# EasyEDA schematic EasyEDA SCH_Toasty SMD REFLOW_2022-03-12.json
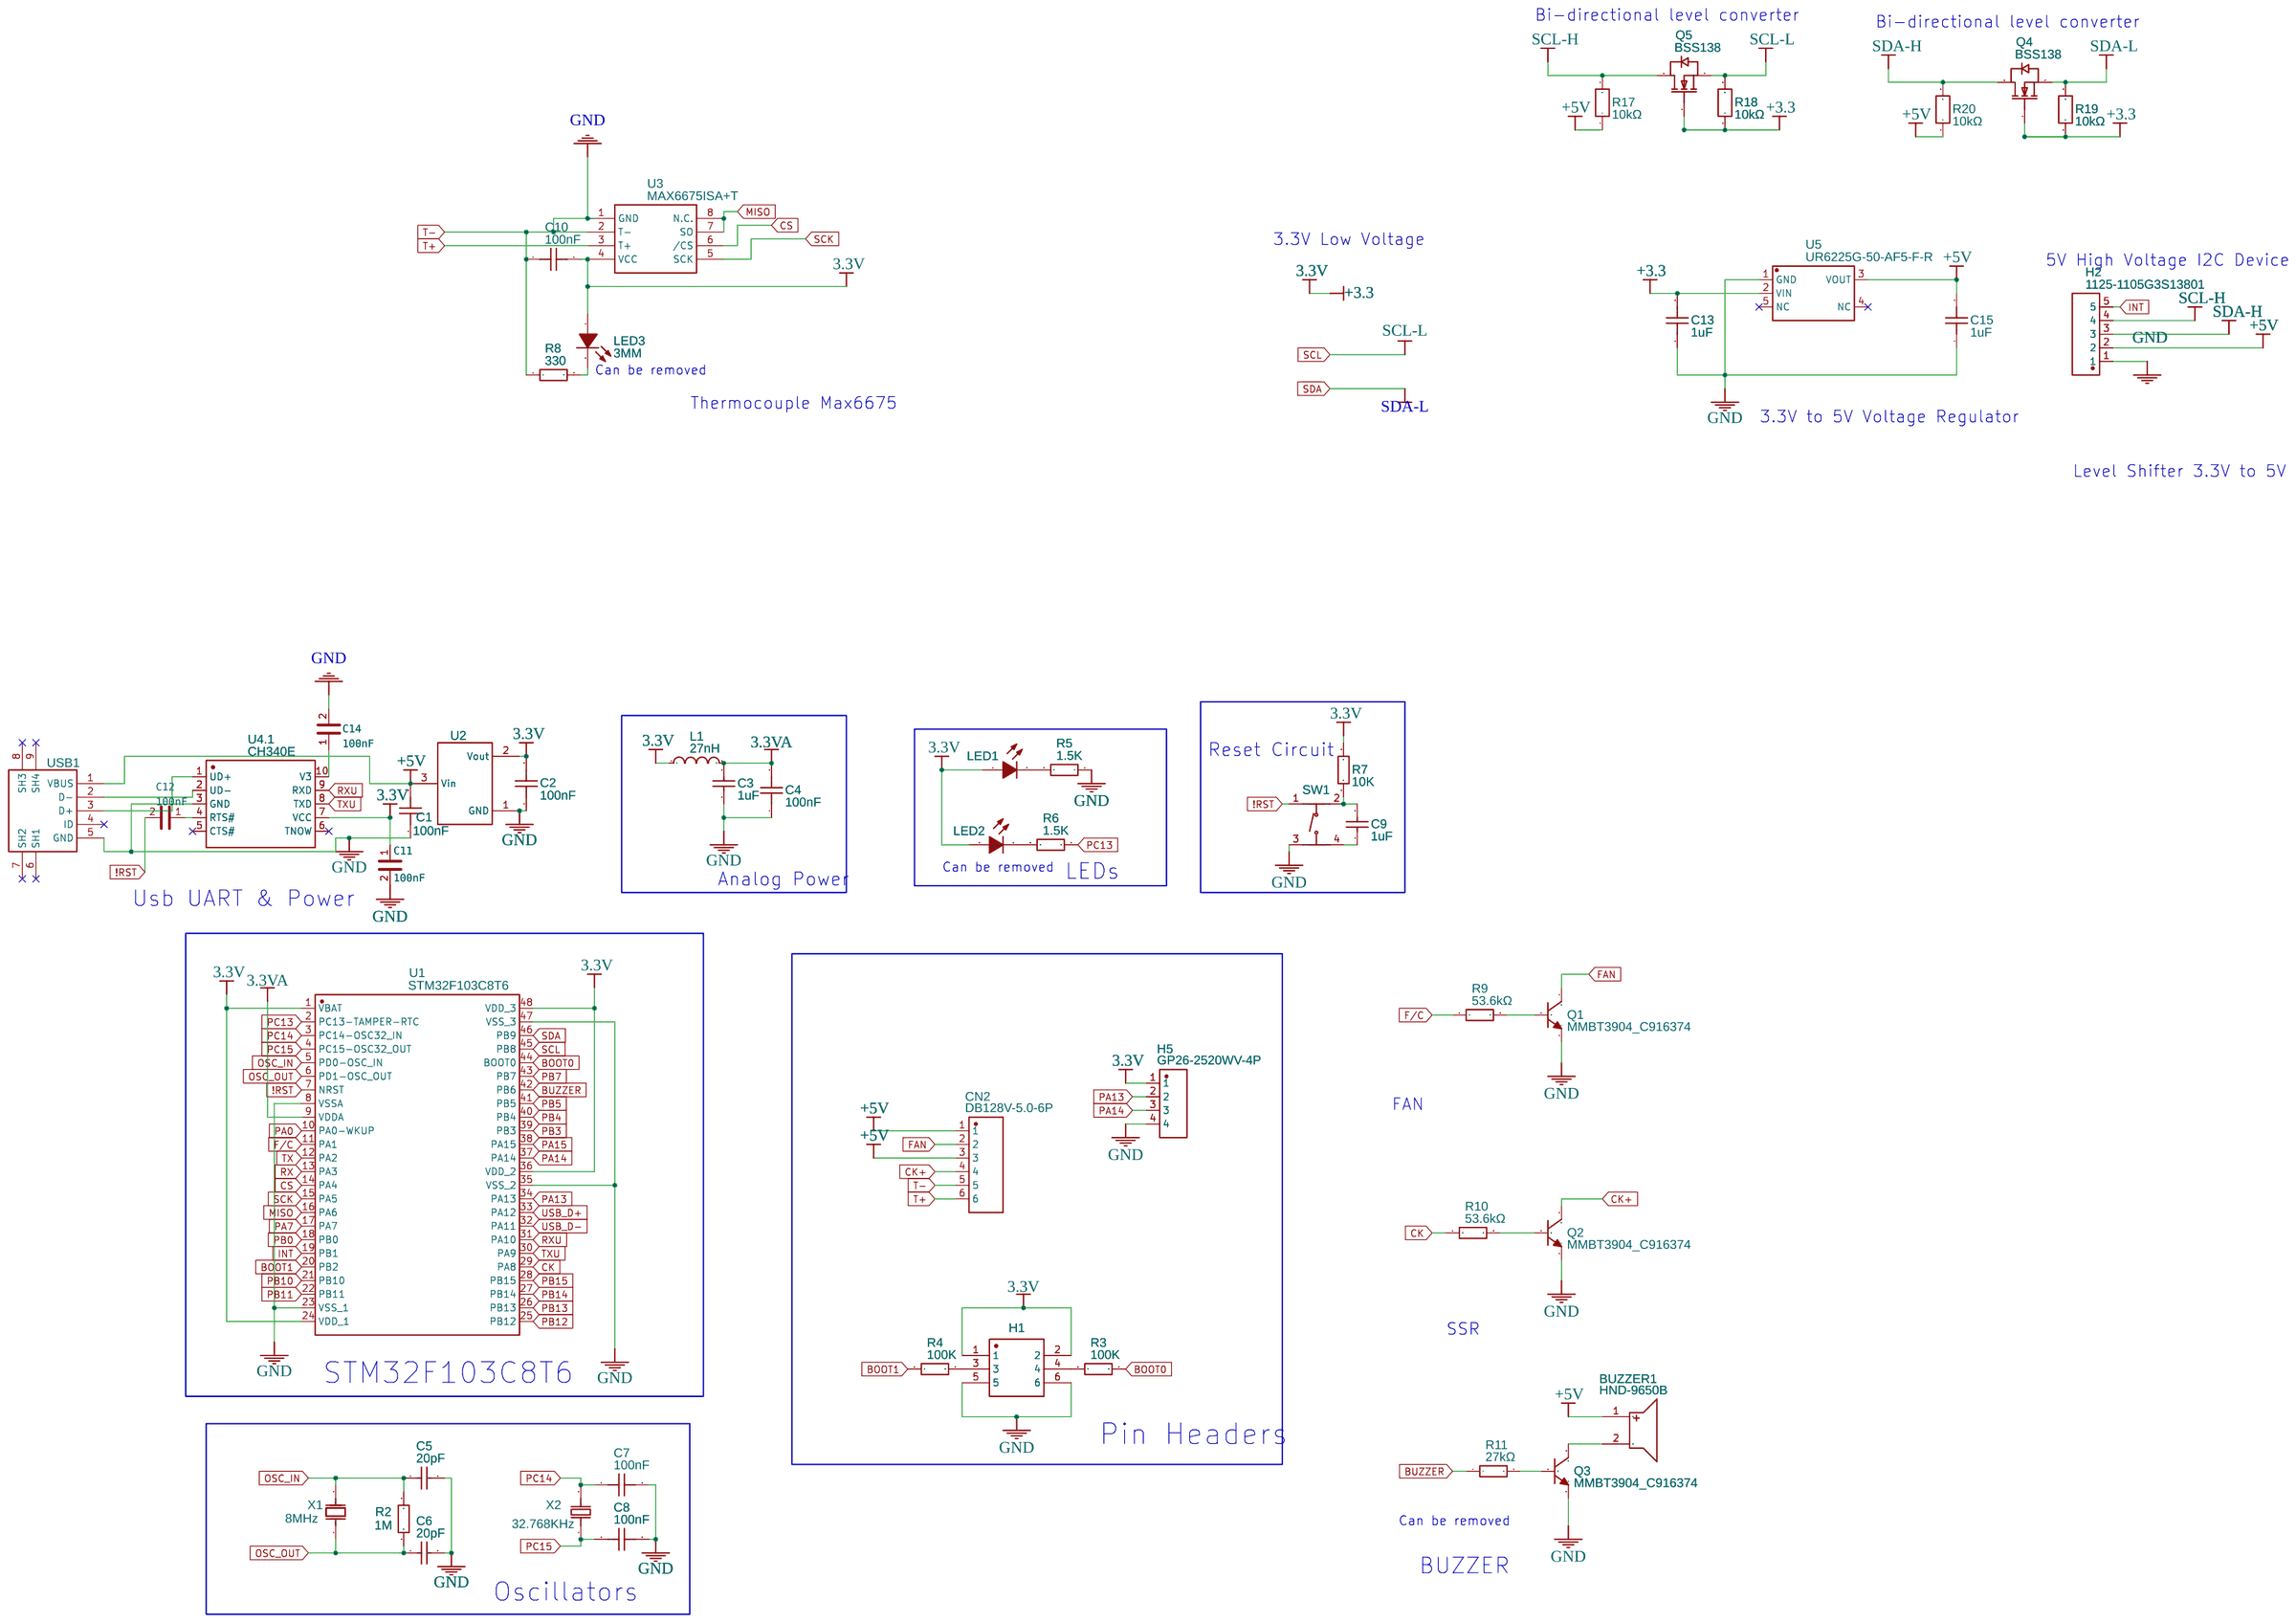
[diagram p0: schematic sheet]

## Parts
BUZZER1  HND-9650B  [BUZ-SMD_L9.6-W9.6-LS10.0-R]
C1  100nF  [C0603]
C2  100nF  [C0603]
C3  1uF  [C0603]
C4  100nF  [C0603]
C5  20pF  [C0603]
C6  20pF  [C0603]
C7  100nF  [C0603]
C8  100nF  [C0603]
C9  1uF  [C0603]
C10  100nF  [C0603]
C11  100nF  [C_0603]
C12  100nF  [C_0603]
C13  1uF  [C0603]
C14  100nF  [C_0603]
C15  1uF  [C0603]
CN2  DB128V-5.0-6P  [CONN-TH_6P-P5.00_DB128V]
H1  210S-2*3P L=11.6MMGold-plated black  [HDR-TH_6P-P2.54-V-R2-C3-S2.54]
H2  1125-1105G3S13801  [HDR-TH_5P-P2.54-V-M]
H5  GP26-2520WV-4P  [HDR-TH_4P-P2.54-V-F-R1-C4]
L1  27nH  [L0603]
LED1  19-217/GHC-YR1S2/3T  [LED0603-R-RD]
LED2  19-217/GHC-YR1S2/3T  [LED0603-R-RD]
LED3  3MM  [LED-TH_BD3.8-P2.54-FD]
Q1  MMBT3904_C916374  [SOT-23-3_L2.9-W1.3-P1.90-LS2.4-BR]
Q2  MMBT3904_C916374  [SOT-23-3_L2.9-W1.3-P1.90-LS2.4-BR]
Q3  MMBT3904_C916374  [SOT-23-3_L2.9-W1.3-P1.90-LS2.4-BR]
Q4  BSS138  [SOT-23-3]
Q5  BSS138  [SOT-23-3]
R2  1M  [R0603]
R3  100K  [R0603]
R4  100K  [R0603]
R5  1.5K  [R0603]
R6  1.5K  [R0603]
R7  10K  [R0603]
R8  330  [0603]
R9  53.6kΩ  [R0402]
R10  53.6kΩ  [R0402]
R11  27kΩ  [R0402]
R17  10kΩ  [R0402]
R18  10kΩ  [R0402]
R19  10kΩ  [R0402]
R20  10kΩ  [R0402]
SW1  TS-1187A-B-A-B  [SW-SMD_4P-L5.1-W5.1-P3.70-LS6.5]
U1  STM32F103C8T6  [LQFP-48_L7.0-W7.0-P0.50-LS9.0-BL]
U2  XC6206P332MR  [SOT-23-3_L2.9-W1.6-P1.90-LS2.8-BR]
U3  MAX6675ISA+T  [SOIC-8_150MIL]
U4  CH340E  [MSOP-10_L3.0-W3.0-P0.50-LS5.0-BL]  (section 1)
U5  UR6225G-50-AF5-F-R  [SOT-23-5_L3.0-W1.7-P0.95-LS2.8-BR]
USB1  MICROXNJ  [MICRO-USB-SMD_MICROXNJ]
X1  8MHz  [OSC-SMD_L5.0-W3.2]
X2  32.768KHz  [FC-135R_L3.2-W1.5]

## Library data of the parts
BUZZER1 = HND-9650B: Supplier: LCSC; Manufacturer: HNDZ; Contributor: LCSC; Supplier Part: C96127; JLCPCB Part Class: Extended Part; Frequency: 2700Hz
C1 C2 C4 C7 C8 = CC0603KRX7R9BB104: Supplier: LCSC; Manufacturer: YAGEO; Supplier Part: C14663; SMT Type: Basic; JLCPCB SMD: Yes; LCSC Assembly: Yes
C3 C9 = CL10A105KB8NNNC: Supplier: LCSC; Manufacturer: SAMSUNG; Supplier Part: C15849; SMT Type: Basic; JLCPCB SMD: Yes; LCSC Assembly: Yes
C5 C6 = CL10C200JB8NNNC: Supplier: LCSC; Manufacturer: SAMSUNG; Supplier Part: C1648; SMT Type: Basic; JLCPCB SMD: Yes; LCSC Assembly: Yes
C10 = C0603X104K050T: Supplier: LCSC; Supplier Part: C187860; Manufacturer: Holy Stone Enterprise; Contributor: LCSC
C11 C12 C14 = -: Supplier: LCSC; Manufacturer: Johanson Dielectrics; Manufacturer Part: 500R14W104KV4T; Supplier Part: C173232
C13 C15 = 0603B105K160NT: Supplier: LCSC; Manufacturer: FH; Supplier Part: C93816; JLCPCB Part Class: Extended Part
CN2 = DB128V-5.0-6P: Supplier: LCSC; Supplier Part: C424686; Manufacturer: DIBO; Contributor: LCSC; JLCPCB Part Class: Extended Part
H1 = 210S-2*3P L=11.6MMGold-plated black: Supplier: LCSC; Manufacturer: Ckmtw; Contributor: LCSC; Supplier Part: C124384; LCSC Assembly: Yes; SMT Type: Extend
H2 = 1125-1105G3S13801: Supplier: LCSC; Supplier Part: C721446; Manufacturer: Wcon; Contributor: LCSC; JLCPCB Part Class: Extended Part
H5 = GP26-2520WV-4P: Supplier: LCSC; Supplier Part: C2681739; Manufacturer: GEPU(歌普); Contributor: LCSC; JLCPCB Part Class: Extended Part
L1 = SDCL1608C27NJTDF: Supplier: LCSC; Manufacturer: Sunlord; Supplier Part: C12100; SMT Type: Basic; JLCPCB SMD: Yes; LCSC Assembly: Yes
LED1 LED2 = 19-217/GHC-YR1S2/3T: Supplier: LCSC; Manufacturer: EVERLIGHT; image: //image.lceda.cn/szlcsc/C72043.jpg; Supplier Part: C72043; SMT Type: Basic; JLCPCB SMD: Yes; LCSC Assembly: Yes
LED3 = -: Supplier: LCSC; Manufacturer: EVERLIGHT; Manufacturer Part: 204-10SYGD/S530-E3; image: //image.lceda.cn/szlcsc/C85161.jpg; Supplier Part: C85161
Q1-Q3 = MMBT3904_C916374: Supplier: LCSC; Supplier Part: C916374; Manufacturer: JSMSEMI; Manufacturer Part: MMBT3904; Contributor: LCSC; JLCPCB Part Class: Extended Part
Q4 Q5 = -: Supplier: LCSC; Manufacturer: CJ; Supplier Part: C78284
R2 = 0603WAF1004T5E: Supplier: LCSC; Manufacturer: UniOhm; Supplier Part: C22935; SMT Type: Basic; JLCPCB SMD: Yes; LCSC Assembly: Yes
R3 R4 = 0603WAF1003T5E: Supplier: LCSC; Manufacturer: UniOhm; Supplier Part: C25803; SMT Type: Basic; JLCPCB SMD: Yes; LCSC Assembly: Yes
R5 R6 = 0603WAF1501T5E: Supplier: LCSC; Manufacturer: UniOhm; Supplier Part: C22843; SMT Type: Basic; JLCPCB SMD: Yes; LCSC Assembly: Yes
R7 = 0603WAF1002T5E: Supplier: LCSC; Manufacturer: UniOhm; Supplier Part: C25804; SMT Type: Basic; JLCPCB SMD: Yes; LCSC Assembly: Yes
R8 = RTT03330JTP: Supplier: LCSC; Manufacturer: RALEC; Supplier Part: C103547
R9 R10 = 0402WGF5362TCE: Supplier: LCSC; Manufacturer: UniOhm; Supplier Part: C53398; Resistance (Ohms): 53.6K; JLCPCB Part Class: Extended Part
R11 = RC-02W2702FT: Supplier: LCSC; Supplier Part: C304599; Manufacturer: Guangdong Fenghua Advanced Tech; Resistance (Ohms): 27K; Contributor: LCSC; JLCPCB Part Class: Extended Part
R17-R20 = CR-02FL6---10K: Supplier: LCSC; Supplier Part: C406733; Manufacturer: Viking Tech; Resistance (Ohms): 10K; Contributor: LCSC; JLCPCB Part Class: Extended Part
SW1 = TS-1187A-B-A-B: Supplier: LCSC; Supplier Part: C318884; Manufacturer: XKB Enterprise; Contributor: LCSC; SMT Type: Extend; JLCPCB SMD: Yes
U1 = STM32F103C8T6: Supplier: LCSC; Manufacturer: STMicroelectronics; Supplier Part: C8734; SMT Type: Basic; JLCPCB SMD: Yes; LCSC Assembly: Yes
U2 = XC6206P332MR: Supplier: LCSC; Manufacturer: TOREX; image: //image.lceda.cn/szlcsc/C5446.jpg; Supplier Part: C5446; SMT Type: Basic; JLCPCB SMD: Yes; LCSC Assembly: Yes
U3 = -: Supplier: LCSC; Manufacturer: MAXIM; image: //image.lceda.cn/szlcsc/C16030.jpg; Supplier Part: C16030; LCSC Assembly: Yes; SMT Type: Extend
U4 = CH340E: Supplier: LCSC; Manufacturer: WCH; Supplier Part: C99652; JLCPCB Part Class: Extended Part; subpart_no: 1
U5 = UR6225G-50-AF5-F-R: Supplier: LCSC; Manufacturer: UTC; Supplier Part: C95079; JLCPCB Part Class: Extended Part
USB1 = MICROXNJ: Supplier: LCSC; Supplier Part: C404969; Manufacturer: SHOU HAN; Manufacturer Part: MicroXNJ; Contributor: LCSC
X1 = X50328MSB2GI: Supplier: LCSC; Manufacturer: YXC; Supplier Part: C115962; SMT Type: Basic; JLCPCB SMD: Yes; LCSC Assembly: Yes
X2 = Q13FC1350000400: Supplier: LCSC; Manufacturer: EPSON; Supplier Part: C32346; SMT Type: Basic; JLCPCB SMD: Yes; LCSC Assembly: Yes

## Nets
3.3VA: C3.2 C4.2 L1.2 U1.9(VDDA)
+5V: BUZZER1.1 C1.2 C15.2 CN2.1 CN2.3 H2.2 R17.1 R20.1 U2.3(Vin) U5.3(VOUT) USB1.1(VBUS)
GND: C1.1 C2.1 C3.1 C4.1 C5.2 C6.2 C7.2 C8.2 C10.1 C11.2 C13.1 C14.2 C15.1 CN2.5 H1.5 H1.6 H2.1 H5.4 Q1.2(E) Q2.2(E) Q3.2(E) R5.1 R8.1 SW1.3(C) U1.8(VSSA) U1.23(VSS_1) U1.35(VSS_2) U1.47(VSS_3) U2.1(GND) U3.1(GND) U3.2(T-) U4.3(GND) U5.1(GND) USB1.5(GND)
!RST: C12.2 SW1.1(A) U1.7(NRST)
+3.3: C2.2 C10.2 C11.1 C13.2 H1.1 H1.2 H5.1 L1.1 LED1.1(A) LED2.1(A) LED3.1(A) Q4.1(G) Q5.1(G) R7.2 R18.1 R19.1 U1.1(VBAT) U1.24(VDD_1) U1.36(VDD_2) U1.48(VDD_3) U2.2(Vout) U3.4(VCC) U4.7(VCC) U5.2(VIN)
BOOT0: R3.2 U1.44(BOOT0)
BOOT1: R4.1 U1.20(PB2)
BUZZER: R11.1 U1.42(PB6)
CK: R10.1 U1.29(PA8)
CK+: CN2.4 Q2.3(C)
CS: U1.14(PA4) U3.6(/CS)
F/C: R9.1 U1.11(PA1)
FAN: CN2.2 Q1.3(C)
INT: H2.5 U1.19(PB1)
MISO: U1.16(PA6) U3.7(SO) U3.8(N.C.)
OSC_IN: C5.1 R2.2 U1.5(PD0-OSC_IN) X1.2(OSC2)
OSC_OUT: C6.1 R2.1 U1.6(PD1-OSC_OUT) X1.1(OSC1)
PA0: U1.10(PA0-WKUP)
PA7: U1.17(PA7)
PA13: H5.2 U1.34(PA13)
PA14: H5.3 U1.37(PA14)
PA15: U1.38(PA15)
PB0: U1.18(PB0)
PB3: U1.39(PB3)
PB4: U1.40(PB4)
PB5: U1.41(PB5)
PB7: U1.43(PB7)
PB10: U1.21(PB10)
PB11: U1.22(PB11)
PB12: U1.25(PB12)
PB13: U1.26(PB13)
PB14: U1.27(PB14)
PB15: U1.28(PB15)
PC13: R6.1 U1.2(PC13-TAMPER-RTC)
PC14: C7.1 U1.3(PC14-OSC32_IN) X2.2
PC15: C8.1 U1.4(PC15-OSC32_OUT) X2.1
RX: U1.13(PA3)
RXU: U1.31(PA10) U4.9(RXD)
SCK: U1.15(PA5) U3.5(SCK)
SCL: Q5.2(S) R18.2 U1.45(PB8)
SCL-H: H2.4 Q5.3(D) R17.2
SDA: Q4.2(S) R19.2 U1.46(PB9)
SDA-H: H2.3 Q4.3(D) R20.2
T+: CN2.6 U3.3(T+)
TX: U1.12(PA2)
TXU: U1.30(PA9) U4.8(TXD)
USB_D+: U1.33(PA12)
USB_D-: U1.32(PA11)
Net-(BUZZER1-2): BUZZER1.2 Q3.3(C)
Net-(C9-1): C9.1 SW1.4(D)
Net-(C9-2): C9.2 R7.1 SW1.2(B)
Net-(C12-1): C12.1 U4.4(RTS#)
Net-(C14-1): C14.1 U4.10(V3)
Net-(H1-3): H1.3 R4.2
Net-(H1-4): H1.4 R3.1
Net-(LED1-2): LED1.2(C) R5.2
Net-(LED2-2): LED2.2(C) R6.2
Net-(LED3-2): LED3.2(K) R8.2
Net-(Q1-1): Q1.1(B) R9.2
Net-(Q2-1): Q2.1(B) R10.2
Net-(Q3-1): Q3.1(B) R11.2
Net-(U4.1-1): U4.1(UD+) USB1.3(D+)
Net-(U4.1-2): U4.2(UD-) USB1.2(D-)

Not connected (* = marked no-connect by the designer): U4 5(CTS#)* 6(TNOW)*; U5 4(NC)* 5(NC)*; USB1 4(ID)* 6(SH1)* 7(SH2)* 8(SH3)* 9(SH4)*

## Notes on the sheet
- Bi-directional level converter
- Bi-directional level converter
- 3.3V Low Voltage
- 5V High Voltage I2C Device
- Can be removed
- Thermocouple Max6675
- 3.3V to 5V Voltage Regulator
- Level Shifter 3.3V to 5V
- Reset Circuit
- Analog Power
- Can be removed
- LEDs
- Usb UART & Power
- FAN
- SSR
- STM32F103C8T6
- Pin Headers
- Can be removed
- BUZZER
- Oscillators
